# Altium schematic sheet CH340.SchDoc
size A4
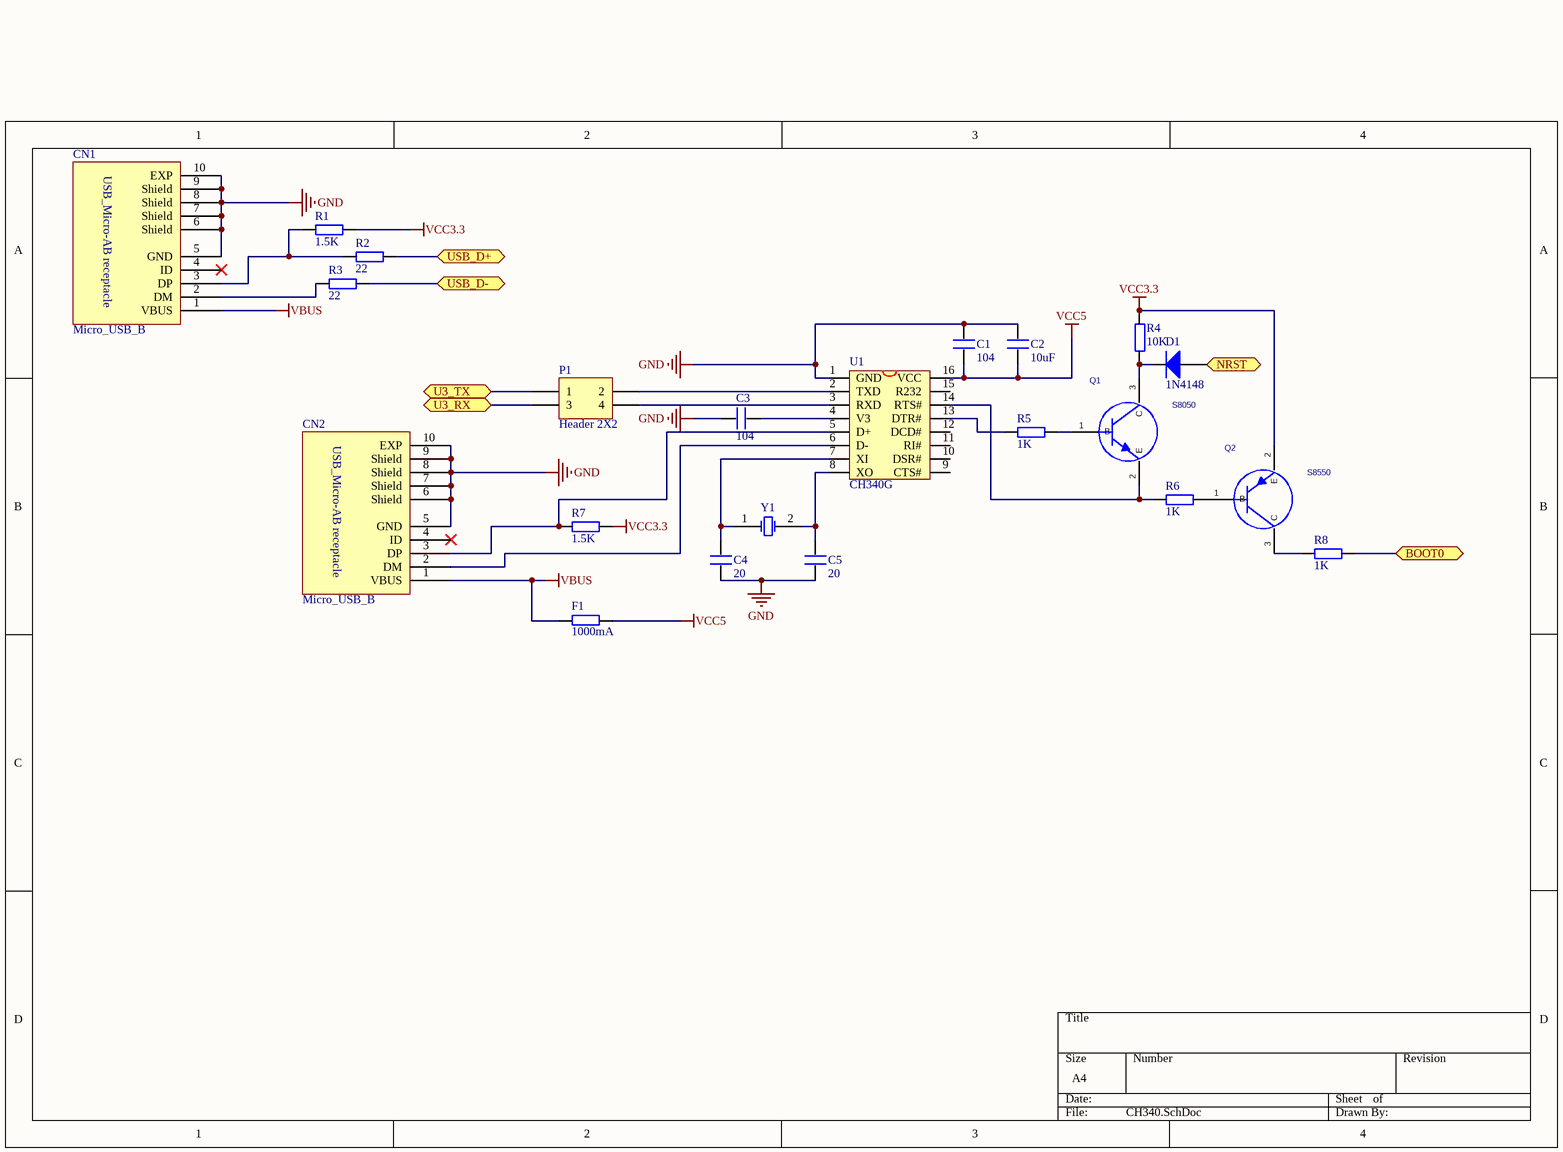
[diagram p0: CH340.SchDoc]

## Parts
C1  104  [0603C]
C2  10uF  [0805C]
C3  104  [0603C]
C4  20  [0603C]
C5  20  [0603C]
CN1  Micro_USB_B  [Molex_1050170001]
CN2  Micro_USB_B  [Molex_1050170001]
D1  1N4148  [DIODE_SOP]
F1  1000mA  [0805F]
P1  Header 2X2  [HDR2X2]
Q1  S8050  [SOT-23]
Q2  S8550  [SOT-23]
R1  1.5K  [0603R]
R2  22  [0603R]
R3  22  [0603R]
R4  10K  [0603R]
R5  1K  [0603R]
R6  1K  [0603R]
R7  1.5K  [0603R]
R8  1K  [0603R]
U1  CH340G  [SOP16_M]
Y1  NX3225GD-8.000M-EXS00A-CG04874[N/A]  [XTAL_SMD]  (value not drawn)

## Ports
BOOT0 (bidir), NRST (bidir), U3_RX (bidir), U3_TX (bidir), USB_D+ (bidir), USB_D- (bidir)

## Nets
GND: C1.2 C2.2 C3.2 C4.1 C5.1 CN1.5(GND) CN1.6(Shield) CN1.7(Shield) CN1.8(Shield) CN1.9(Shield) CN1.10(EXP) CN2.5(GND) CN2.6(Shield) CN2.7(Shield) CN2.8(Shield) CN2.9(Shield) CN2.10(EXP) U1.1(GND)
VBUS: CN1.1(VBUS) CN2.1(VBUS) F1.2
VCC3.3: Q2.2(E) R1.2 R4.2 R7.2
VCC5: C1.1 C2.1 F1.1 U1.16(VCC)
BOOT0: R8.2 ; port BOOT0
NRST: D1.1(A) ; port NRST
U3_RX: P1.3 ; port U3_RX
U3_TX: P1.1 ; port U3_TX
USB_D+: R2.2 ; port USB_D+
USB_D-: R3.2 ; port USB_D-
NetC3_1: C3.1 U1.4(V3)
NetC4_2: C4.2 U1.7(XI) Y1.1(OSC1)
NetC5_2: C5.2 U1.8(XO) Y1.2(OSC2)
NetCN1_2: CN1.2(DM) R3.1
NetCN1_3: CN1.3(DP) R1.1 R2.1
NetCN2_2: CN2.2(DM) U1.6(D-)
NetCN2_3: CN2.3(DP) R7.1 U1.5(D+)
NetD1_2: D1.2(K) Q1.3(C) R4.1
NetP1_2: P1.2 U1.2(TXD)
NetP1_4: P1.4 U1.3(RXD)
NetQ1_1: Q1.1(B) R5.2
NetQ1_2: Q1.2(E) R6.1 U1.14(RTS#)
NetQ2_1: Q2.1(B) R6.2
NetQ2_3: Q2.3(C) R8.1
NetR5_1: R5.1 U1.13(DTR#)

Not connected (* = marked no-connect by the designer): CN1 4(ID)*; CN2 4(ID)*; U1 9(CTS#) 10(DSR#) 11(RI#) 12(DCD#) 15(R232)

## Notes on the sheet
- (in symbol Micro_USB_B) USB_Micro-AB receptacle

## Library data of the parts
C1-C5 = C
D1 = Diode: Default Diode; Code - JEDEC: DO-214-AB; Ordered by: STM; ECCN_US/EU: EAR99/NEC; Published: 8-Jun-2000; Revision: July-2002: Re-released for DXP Platform.; Publisher: Altium Limited
F1 R1-R8 = R
P1 = Header 2X2: Header, 2-Pin, Dual row; LatestRevisionDate: 17-Jul-2002; LatestRevisionNote: Re-released for DXP Platform.; Publisher: Altium Limited
Q1 = S8050: NPN; Manufacturer #2: 8050; PCB DECAL: SOT-23
Q2 = S8550: NPN; Manufacturer #2: 8050; PCB DECAL: SOT-23
U1 = CH340G: USB2UART
Y1 = XTAL: Crystal Oscillator; Published: 8-Jun-2000; LatestRevisionDate: 17-Jul-2002; LatestRevisionNote: Re-released for DXP Platform.; PackageReference: R38; Publisher: Altium Limited